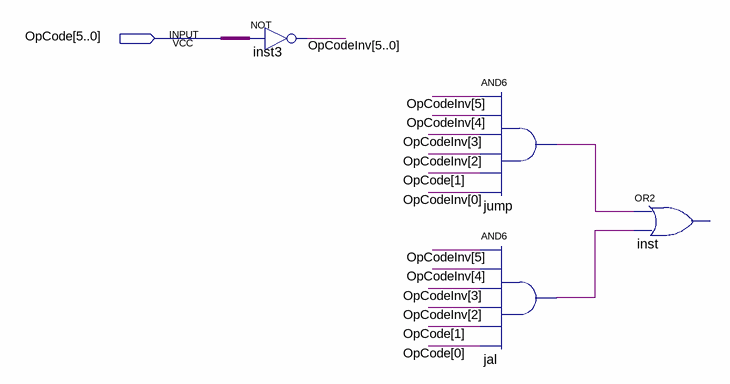
[diagram p0: schematic sheet]
// Quartus schematic JumpControl.bdf as structural Verilog: 4 symbols, 1 pins
module JumpControl (
  input  [5:0] OpCode
);

  wire jal_out, jump_out;
  wire [5:0] OpCodeInv;

  assign OpCodeInv = ~OpCode;  // NOT inst3, 6 bits wide
  and jump (jump_out, OpCodeInv[5], OpCodeInv[4], OpCodeInv[3], OpCodeInv[2], OpCode[1], OpCodeInv[0]);
  and jal (jal_out, OpCodeInv[5], OpCodeInv[4], OpCodeInv[3], OpCodeInv[2], OpCode[1], OpCode[0]);
  // OR2 inst has open pins: IN1=jump_out, IN2=jal_out, OUT=open
endmodule
